# Altium schematic sheet 1.BTB.SchDoc
size A3; SheetNumber: 1; SheetTotal: 13
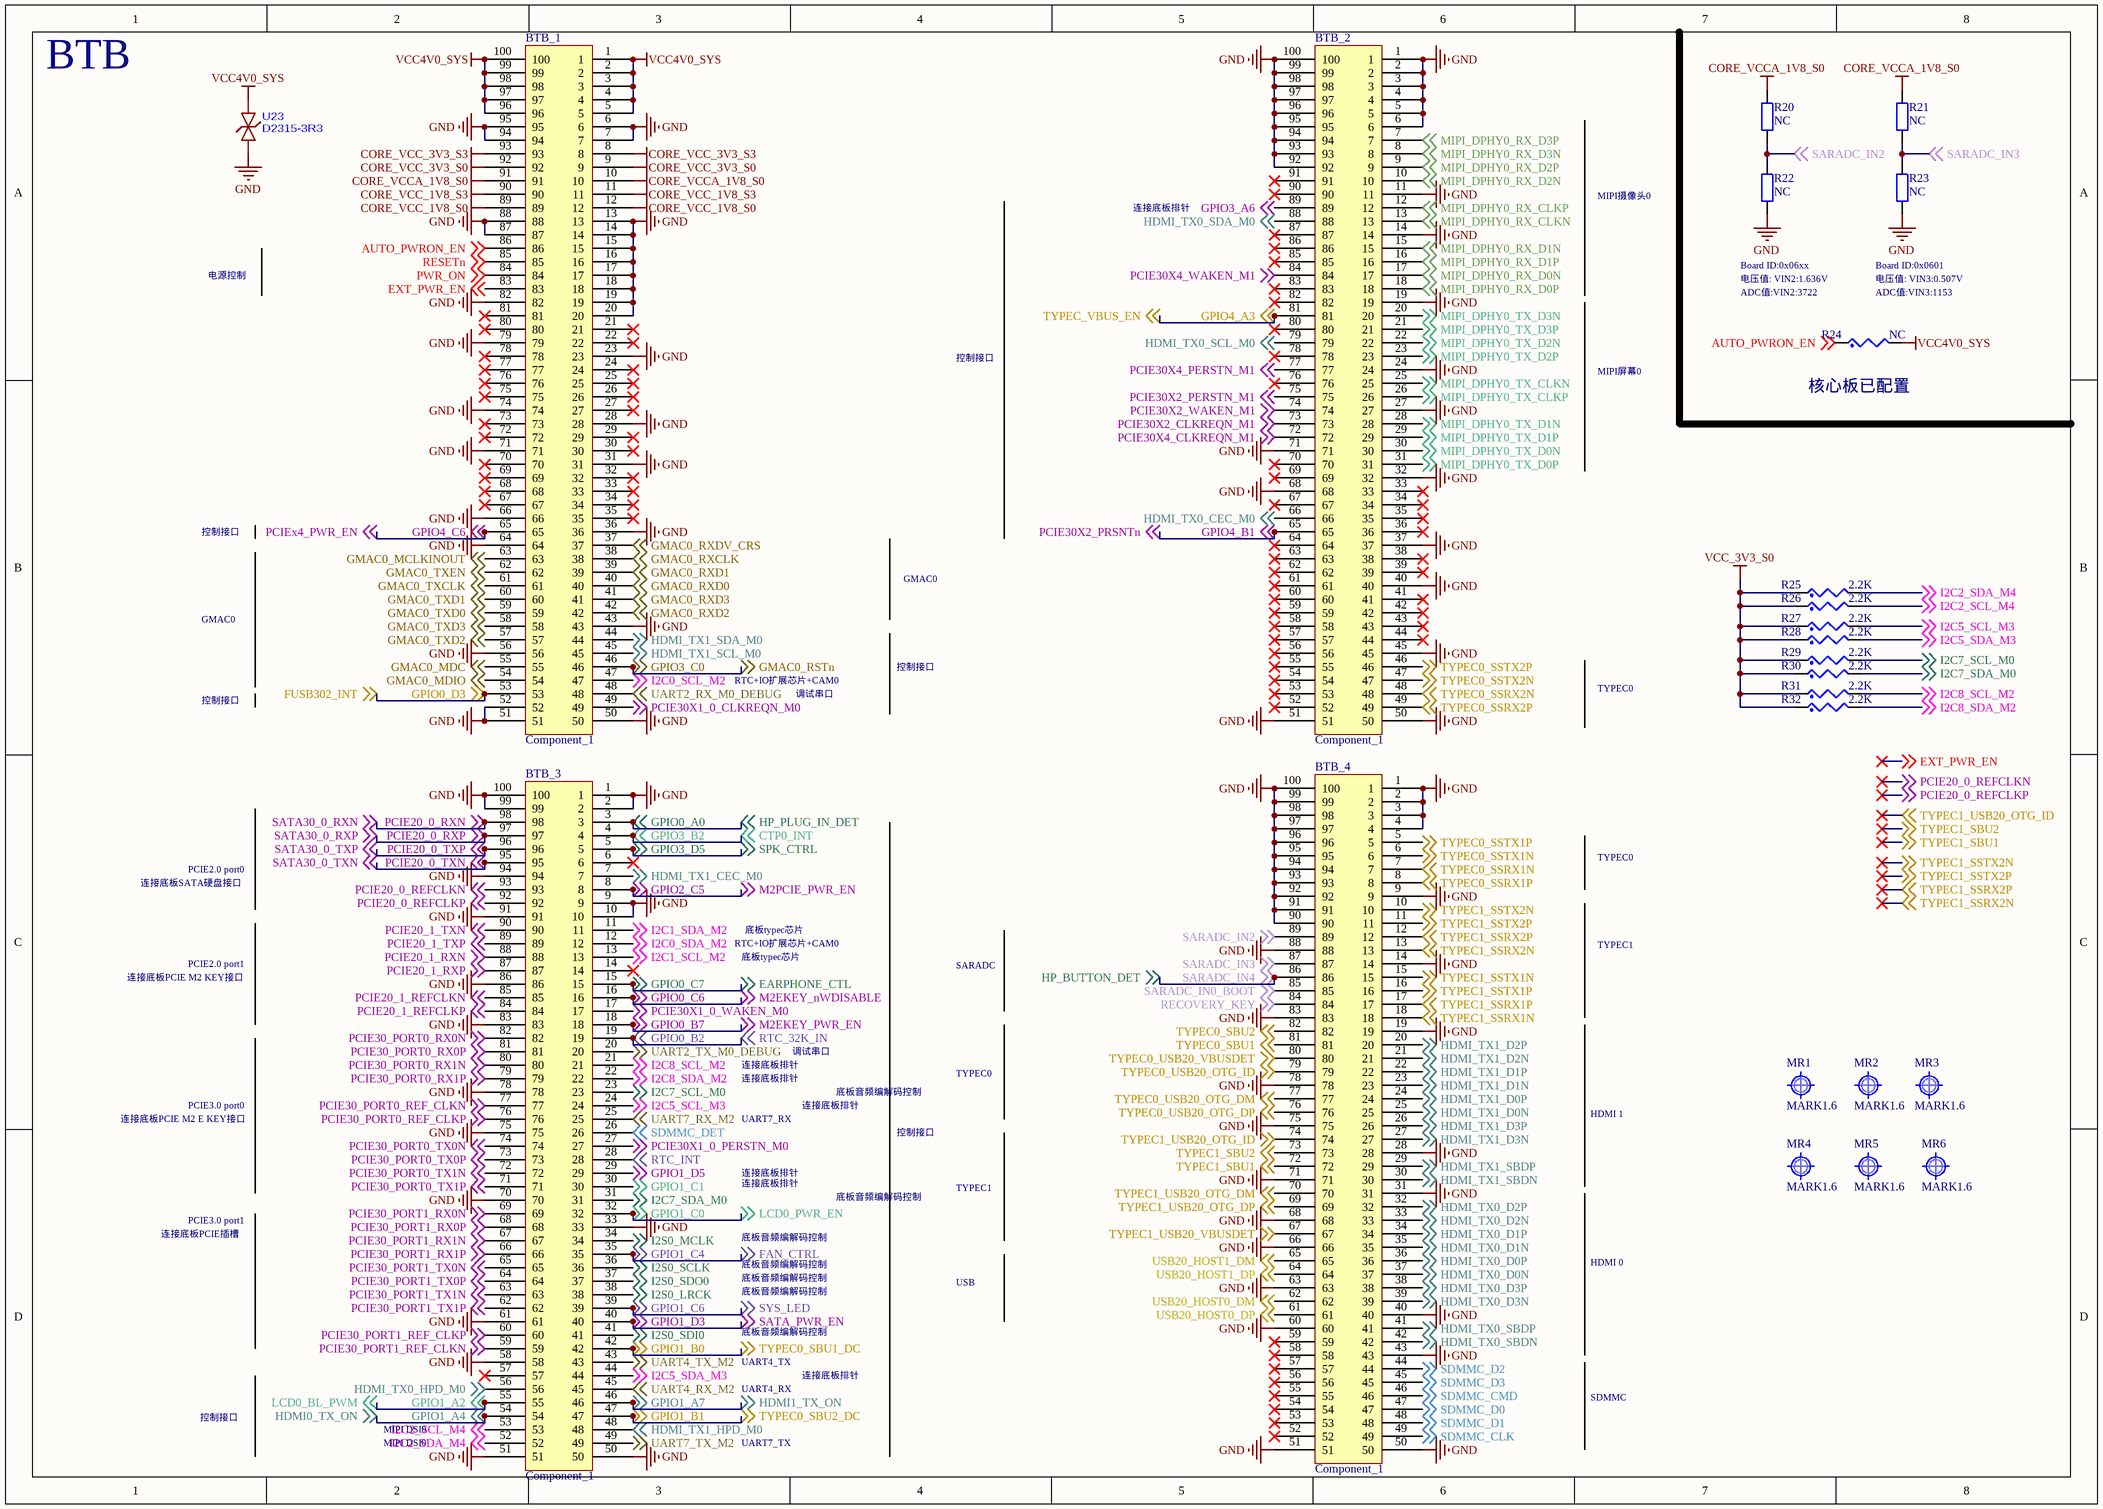
[diagram p0: 1.BTB.SchDoc]

## Parts
BTB_1  Component_1  [F_100PIN]
BTB_2  Component_1  [F_100PIN]
BTB_3  Component_1  [F_100PIN]
BTB_4  Component_1  [F_100PIN]
MR1  MARK1.6  [Mark 1]
MR2  MARK1.6  [Mark 1]
MR3  MARK1.6  [Mark 1]
MR4  MARK1.6  [Mark 1]
MR5  MARK1.6  [Mark 1]
MR6  MARK1.6  [Mark 1]
R20  NC  [R0402_L]
R21  NC  [R0402_L]
R22  NC  [R0402_L]
R23  NC  [R0402_L]
R24  NC  [R0402]
R25  2.2K  [R0402]
R26  2.2K  [R0402]
R27  2.2K  [R0402]
R28  2.2K  [R0402]
R29  2.2K  [R0402]
R30  2.2K  [R0402]
R31  2.2K  [R0402]
R32  2.2K  [R0402]
U23  D2315-3R3  [DFN1006-2L-BI]

## Nets
CORE_VCC_1V8_S0: BTB_1.12 BTB_1.89
CORE_VCC_1V8_S3: BTB_1.11 BTB_1.90
CORE_VCC_3V3_S0: BTB_1.9 BTB_1.92
CORE_VCC_3V3_S3: BTB_1.8 BTB_1.93
CORE_VCCA_1V8_S0: BTB_1.10 BTB_1.91 R20.2 R21.2
GND: BTB_1.6 BTB_1.7 BTB_1.13 BTB_1.14 BTB_1.15 BTB_1.16 BTB_1.17 BTB_1.18 BTB_1.19 BTB_1.20 BTB_1.23 BTB_1.28 BTB_1.31 BTB_1.36 BTB_1.43 BTB_1.50 BTB_1.51 BTB_1.52 BTB_1.56 BTB_1.64 BTB_1.66 BTB_1.71 BTB_1.74 BTB_1.79 BTB_1.82 BTB_1.87 BTB_1.88 BTB_1.94 BTB_1.95 BTB_2.1 BTB_2.2 BTB_2.3 BTB_2.4 BTB_2.5 BTB_2.6 BTB_2.11 BTB_2.14 BTB_2.19 BTB_2.24 BTB_2.27 BTB_2.32 BTB_2.37 BTB_2.40 BTB_2.45 BTB_2.50 BTB_2.51 BTB_2.68 BTB_2.71 BTB_2.92 BTB_2.93 BTB_2.94 BTB_2.95 BTB_2.96 BTB_2.97 BTB_2.98 BTB_2.99 BTB_2.100 BTB_3.1 BTB_3.2 BTB_3.9 BTB_3.10 BTB_3.33 BTB_3.50 BTB_3.51 BTB_3.58 BTB_3.61 BTB_3.70 BTB_3.75 BTB_3.78 BTB_3.83 BTB_3.86 BTB_3.91 BTB_3.94 BTB_3.99 BTB_3.100 BTB_4.1 BTB_4.2 BTB_4.3 BTB_4.4 BTB_4.9 BTB_4.14 BTB_4.19 BTB_4.28 BTB_4.31 BTB_4.40 BTB_4.43 BTB_4.50 BTB_4.51 BTB_4.60 BTB_4.63 BTB_4.66 BTB_4.68 BTB_4.71 BTB_4.75 BTB_4.78 BTB_4.83 BTB_4.88 BTB_4.90 BTB_4.91 BTB_4.92 BTB_4.93 BTB_4.94 BTB_4.95 BTB_4.96 BTB_4.97 BTB_4.98 BTB_4.99 BTB_4.100 R22.1 R23.1 U23.1
VCC4V0_SYS: BTB_1.1 BTB_1.2 BTB_1.3 BTB_1.4 BTB_1.5 BTB_1.96 BTB_1.97 BTB_1.98 BTB_1.99 BTB_1.100 R24.2 U23.2
VCC_3V3_S0: R25.1 R26.1 R27.1 R28.1 R29.1 R30.1 R31.1 R32.1
AUTO_PWRON_EN: BTB_1.86 R24.1 ; off-sheet AUTO_PWRON_EN
CTP0_INT: BTB_3.4 ; off-sheet GPIO3_B2, off-sheet CTP0_INT  [also labelled GPIO3_B2]
EARPHONE_CTL: BTB_3.15 ; off-sheet GPIO0_C7, off-sheet EARPHONE_CTL  [also labelled GPIO0_C7]
EXT_PWR_EN: BTB_1.83 ; off-sheet EXT_PWR_EN
FAN_CTRL: BTB_3.35 ; off-sheet GPIO1_C4, off-sheet FAN_CTRL  [also labelled GPIO1_C4]
FUSB302_INT: BTB_1.53 ; off-sheet GPIO0_D3, off-sheet FUSB302_INT  [also labelled GPIO0_D3]
GMAC0_MCLKINOUT: BTB_1.63 ; off-sheet GMAC0_MCLKINOUT
GMAC0_MDC: BTB_1.55 ; off-sheet GMAC0_MDC
GMAC0_MDIO: BTB_1.54 ; off-sheet GMAC0_MDIO
GMAC0_RSTn: BTB_1.46 ; off-sheet GPIO3_C0, off-sheet GMAC0_RSTn  [also labelled GPIO3_C0]
GMAC0_RXCLK: BTB_1.38 ; off-sheet GMAC0_RXCLK
GMAC0_RXD0: BTB_1.40 ; off-sheet GMAC0_RXD0
GMAC0_RXD1: BTB_1.39 ; off-sheet GMAC0_RXD1
GMAC0_RXD2: BTB_1.42 ; off-sheet GMAC0_RXD2
GMAC0_RXD3: BTB_1.41 ; off-sheet GMAC0_RXD3
GMAC0_RXDV_CRS: BTB_1.37 ; off-sheet GMAC0_RXDV_CRS
GMAC0_TXCLK: BTB_1.61 ; off-sheet GMAC0_TXCLK
GMAC0_TXD0: BTB_1.59 ; off-sheet GMAC0_TXD0
GMAC0_TXD1: BTB_1.60 ; off-sheet GMAC0_TXD1
GMAC0_TXD2: BTB_1.57 ; off-sheet GMAC0_TXD2
GMAC0_TXD3: BTB_1.58 ; off-sheet GMAC0_TXD3
GMAC0_TXEN: BTB_1.62 ; off-sheet GMAC0_TXEN
GPIO0_A0: BTB_3.3 ; off-sheet GPIO0_A0, off-sheet HP_PLUG_IN_DET  [also labelled HP_PLUG_IN_DET]
GPIO0_B2: BTB_3.19 ; off-sheet GPIO0_B2, off-sheet RTC_32K_IN  [also labelled RTC_32K_IN]
GPIO0_B7: BTB_3.18 ; off-sheet GPIO0_B7, off-sheet M2EKEY_PWR_EN  [also labelled M2EKEY_PWR_EN]
GPIO0_C6: BTB_3.16 ; off-sheet GPIO0_C6, off-sheet M2EKEY_nWDISABLE  [also labelled M2EKEY_nWDISABLE]
GPIO1_A2: BTB_3.55 ; off-sheet GPIO1_A2, off-sheet LCD0_BL_PWM  [also labelled LCD0_BL_PWM]
GPIO1_A4: BTB_3.54 ; off-sheet GPIO1_A4, off-sheet HDMI0_TX_ON  [also labelled HDMI0_TX_ON]
GPIO1_A7: BTB_3.46 ; off-sheet GPIO1_A7, off-sheet HDMI1_TX_ON  [also labelled HDMI1_TX_ON]
GPIO1_B0: BTB_3.42 ; off-sheet GPIO1_B0, off-sheet TYPEC0_SBU1_DC  [also labelled TYPEC0_SBU1_DC]
GPIO1_B1: BTB_3.47 ; off-sheet GPIO1_B1, off-sheet TYPEC0_SBU2_DC  [also labelled TYPEC0_SBU2_DC]
GPIO1_C0: BTB_3.32 ; off-sheet GPIO1_C0, off-sheet LCD0_PWR_EN  [also labelled LCD0_PWR_EN]
GPIO1_C1: BTB_3.30 ; off-sheet GPIO1_C1
GPIO1_C6: BTB_3.39 ; off-sheet GPIO1_C6, off-sheet SYS_LED  [also labelled SYS_LED]
GPIO1_D3: BTB_3.40 ; off-sheet GPIO1_D3, off-sheet SATA_PWR_EN  [also labelled SATA_PWR_EN]
GPIO1_D5: BTB_3.29 ; off-sheet GPIO1_D5
GPIO2_C5: BTB_3.8 ; off-sheet GPIO2_C5, off-sheet M2PCIE_PWR_EN  [also labelled M2PCIE_PWR_EN]
GPIO3_A6: BTB_2.89 ; off-sheet GPIO3_A6
GPIO3_D5: BTB_3.5 ; off-sheet GPIO3_D5, off-sheet SPK_CTRL  [also labelled SPK_CTRL]
GPIO4_A3: BTB_2.81 ; off-sheet GPIO4_A3, off-sheet TYPEC_VBUS_EN  [also labelled TYPEC_VBUS_EN]
GPIO4_B1: BTB_2.65 ; off-sheet GPIO4_B1, off-sheet PCIE30X2_PRSNTn  [also labelled PCIE30X2_PRSNTn]
GPIO4_C6: BTB_1.65 ; off-sheet GPIO4_C6, off-sheet PCIEx4_PWR_EN  [also labelled PCIEx4_PWR_EN]
HDMI_TX0_CEC_M0: BTB_2.66 ; off-sheet HDMI_TX0_CEC_M0
HDMI_TX0_D0N: BTB_4.37 ; off-sheet HDMI_TX0_D0N
HDMI_TX0_D0P: BTB_4.36 ; off-sheet HDMI_TX0_D0P
HDMI_TX0_D1N: BTB_4.35 ; off-sheet HDMI_TX0_D1N
HDMI_TX0_D1P: BTB_4.34 ; off-sheet HDMI_TX0_D1P
HDMI_TX0_D2N: BTB_4.33 ; off-sheet HDMI_TX0_D2N
HDMI_TX0_D2P: BTB_4.32 ; off-sheet HDMI_TX0_D2P
HDMI_TX0_D3N: BTB_4.39 ; off-sheet HDMI_TX0_D3N
HDMI_TX0_D3P: BTB_4.38 ; off-sheet HDMI_TX0_D3P
HDMI_TX0_HPD_M0: BTB_3.56 ; off-sheet HDMI_TX0_HPD_M0
HDMI_TX0_SBDN: BTB_4.42 ; off-sheet HDMI_TX0_SBDN
HDMI_TX0_SBDP: BTB_4.41 ; off-sheet HDMI_TX0_SBDP
HDMI_TX0_SCL_M0: BTB_2.79 ; off-sheet HDMI_TX0_SCL_M0
HDMI_TX0_SDA_M0: BTB_2.88 ; off-sheet HDMI_TX0_SDA_M0
HDMI_TX1_CEC_M0: BTB_3.7 ; off-sheet HDMI_TX1_CEC_M0
HDMI_TX1_D0N: BTB_4.25 ; off-sheet HDMI_TX1_D0N
HDMI_TX1_D0P: BTB_4.24 ; off-sheet HDMI_TX1_D0P
HDMI_TX1_D1N: BTB_4.23 ; off-sheet HDMI_TX1_D1N
HDMI_TX1_D1P: BTB_4.22 ; off-sheet HDMI_TX1_D1P
HDMI_TX1_D2N: BTB_4.21 ; off-sheet HDMI_TX1_D2N
HDMI_TX1_D2P: BTB_4.20 ; off-sheet HDMI_TX1_D2P
HDMI_TX1_D3N: BTB_4.27 ; off-sheet HDMI_TX1_D3N
HDMI_TX1_D3P: BTB_4.26 ; off-sheet HDMI_TX1_D3P
HDMI_TX1_HPD_M0: BTB_3.48 ; off-sheet HDMI_TX1_HPD_M0
HDMI_TX1_SBDN: BTB_4.30 ; off-sheet HDMI_TX1_SBDN
HDMI_TX1_SBDP: BTB_4.29 ; off-sheet HDMI_TX1_SBDP
HDMI_TX1_SCL_M0: BTB_1.45 ; off-sheet HDMI_TX1_SCL_M0
HDMI_TX1_SDA_M0: BTB_1.44 ; off-sheet HDMI_TX1_SDA_M0
HP_BUTTON_DET: BTB_4.86 ; off-sheet SARADC_IN4, off-sheet HP_BUTTON_DET  [also labelled SARADC_IN4]
I2C0_SCL_M2: BTB_1.47 ; off-sheet I2C0_SCL_M2
I2C0_SDA_M2: BTB_3.12 ; off-sheet I2C0_SDA_M2
I2C1_SCL_M2: BTB_3.13 ; off-sheet I2C1_SCL_M2
I2C1_SDA_M2: BTB_3.11 ; off-sheet I2C1_SDA_M2
I2C2_SCL_M4: BTB_3.53 R26.2 ; off-sheet I2C2_SCL_M4
I2C2_SDA_M4: BTB_3.52 R25.2 ; off-sheet I2C2_SDA_M4
I2C5_SCL_M3: BTB_3.24 R27.2 ; off-sheet I2C5_SCL_M3
I2C5_SDA_M3: BTB_3.44 R28.2 ; off-sheet I2C5_SDA_M3
I2C7_SCL_M0: BTB_3.23 R29.2 ; off-sheet I2C7_SCL_M0
I2C7_SDA_M0: BTB_3.31 R30.2 ; off-sheet I2C7_SDA_M0
I2C8_SCL_M2: BTB_3.21 R31.2 ; off-sheet I2C8_SCL_M2
I2C8_SDA_M2: BTB_3.22 R32.2 ; off-sheet I2C8_SDA_M2
I2S0_LRCK: BTB_3.38 ; off-sheet I2S0_LRCK
I2S0_MCLK: BTB_3.34 ; off-sheet I2S0_MCLK
I2S0_SCLK: BTB_3.36 ; off-sheet I2S0_SCLK
I2S0_SDI0: BTB_3.41 ; off-sheet I2S0_SDI0
I2S0_SDO0: BTB_3.37 ; off-sheet I2S0_SDO0
MIPI_DPHY0_RX_CLKN: BTB_2.13 ; off-sheet MIPI_DPHY0_RX_CLKN
MIPI_DPHY0_RX_CLKP: BTB_2.12 ; off-sheet MIPI_DPHY0_RX_CLKP
MIPI_DPHY0_RX_D0N: BTB_2.17 ; off-sheet MIPI_DPHY0_RX_D0N
MIPI_DPHY0_RX_D0P: BTB_2.18 ; off-sheet MIPI_DPHY0_RX_D0P
MIPI_DPHY0_RX_D1N: BTB_2.15 ; off-sheet MIPI_DPHY0_RX_D1N
MIPI_DPHY0_RX_D1P: BTB_2.16 ; off-sheet MIPI_DPHY0_RX_D1P
MIPI_DPHY0_RX_D2N: BTB_2.10 ; off-sheet MIPI_DPHY0_RX_D2N
MIPI_DPHY0_RX_D2P: BTB_2.9 ; off-sheet MIPI_DPHY0_RX_D2P
MIPI_DPHY0_RX_D3N: BTB_2.8 ; off-sheet MIPI_DPHY0_RX_D3N
MIPI_DPHY0_RX_D3P: BTB_2.7 ; off-sheet MIPI_DPHY0_RX_D3P
MIPI_DPHY0_TX_CLKN: BTB_2.25 ; off-sheet MIPI_DPHY0_TX_CLKN
MIPI_DPHY0_TX_CLKP: BTB_2.26 ; off-sheet MIPI_DPHY0_TX_CLKP
MIPI_DPHY0_TX_D0N: BTB_2.30 ; off-sheet MIPI_DPHY0_TX_D0N
MIPI_DPHY0_TX_D0P: BTB_2.31 ; off-sheet MIPI_DPHY0_TX_D0P
MIPI_DPHY0_TX_D1N: BTB_2.28 ; off-sheet MIPI_DPHY0_TX_D1N
MIPI_DPHY0_TX_D1P: BTB_2.29 ; off-sheet MIPI_DPHY0_TX_D1P
MIPI_DPHY0_TX_D2N: BTB_2.22 ; off-sheet MIPI_DPHY0_TX_D2N
MIPI_DPHY0_TX_D2P: BTB_2.23 ; off-sheet MIPI_DPHY0_TX_D2P
MIPI_DPHY0_TX_D3N: BTB_2.20 ; off-sheet MIPI_DPHY0_TX_D3N
MIPI_DPHY0_TX_D3P: BTB_2.21 ; off-sheet MIPI_DPHY0_TX_D3P
PCIE20_0_REFCLKN: BTB_3.93 ; off-sheet PCIE20_0_REFCLKN
PCIE20_0_REFCLKP: BTB_3.92 ; off-sheet PCIE20_0_REFCLKP
PCIE20_0_RXN: BTB_3.98 ; off-sheet PCIE20_0_RXN, off-sheet SATA30_0_RXN  [also labelled SATA30_0_RXN]
PCIE20_0_RXP: BTB_3.97 ; off-sheet PCIE20_0_RXP, off-sheet SATA30_0_RXP  [also labelled SATA30_0_RXP]
PCIE20_0_TXN: BTB_3.95 ; off-sheet PCIE20_0_TXN, off-sheet SATA30_0_TXN  [also labelled SATA30_0_TXN]
PCIE20_0_TXP: BTB_3.96 ; off-sheet PCIE20_0_TXP, off-sheet SATA30_0_TXP  [also labelled SATA30_0_TXP]
PCIE20_1_REFCLKN: BTB_3.85 ; off-sheet PCIE20_1_REFCLKN
PCIE20_1_REFCLKP: BTB_3.84 ; off-sheet PCIE20_1_REFCLKP
PCIE20_1_RXN: BTB_3.88 ; off-sheet PCIE20_1_RXN
PCIE20_1_RXP: BTB_3.87 ; off-sheet PCIE20_1_RXP
PCIE20_1_TXN: BTB_3.90 ; off-sheet PCIE20_1_TXN
PCIE20_1_TXP: BTB_3.89 ; off-sheet PCIE20_1_TXP
PCIE30_PORT0_REF_CLKN: BTB_3.77 ; off-sheet PCIE30_PORT0_REF_CLKN
PCIE30_PORT0_REF_CLKP: BTB_3.76 ; off-sheet PCIE30_PORT0_REF_CLKP
PCIE30_PORT0_RX0N: BTB_3.82 ; off-sheet PCIE30_PORT0_RX0N
PCIE30_PORT0_RX0P: BTB_3.81 ; off-sheet PCIE30_PORT0_RX0P
PCIE30_PORT0_RX1N: BTB_3.80 ; off-sheet PCIE30_PORT0_RX1N
PCIE30_PORT0_RX1P: BTB_3.79 ; off-sheet PCIE30_PORT0_RX1P
PCIE30_PORT0_TX0N: BTB_3.74 ; off-sheet PCIE30_PORT0_TX0N
PCIE30_PORT0_TX0P: BTB_3.73 ; off-sheet PCIE30_PORT0_TX0P
PCIE30_PORT0_TX1N: BTB_3.72 ; off-sheet PCIE30_PORT0_TX1N
PCIE30_PORT0_TX1P: BTB_3.71 ; off-sheet PCIE30_PORT0_TX1P
PCIE30_PORT1_REF_CLKN: BTB_3.59 ; off-sheet PCIE30_PORT1_REF_CLKN
PCIE30_PORT1_REF_CLKP: BTB_3.60 ; off-sheet PCIE30_PORT1_REF_CLKP
PCIE30_PORT1_RX0N: BTB_3.69 ; off-sheet PCIE30_PORT1_RX0N
PCIE30_PORT1_RX0P: BTB_3.68 ; off-sheet PCIE30_PORT1_RX0P
PCIE30_PORT1_RX1N: BTB_3.67 ; off-sheet PCIE30_PORT1_RX1N
PCIE30_PORT1_RX1P: BTB_3.66 ; off-sheet PCIE30_PORT1_RX1P
PCIE30_PORT1_TX0N: BTB_3.65 ; off-sheet PCIE30_PORT1_TX0N
PCIE30_PORT1_TX0P: BTB_3.64 ; off-sheet PCIE30_PORT1_TX0P
PCIE30_PORT1_TX1N: BTB_3.63 ; off-sheet PCIE30_PORT1_TX1N
PCIE30_PORT1_TX1P: BTB_3.62 ; off-sheet PCIE30_PORT1_TX1P
PCIE30X1_0_CLKREQN_M0: BTB_1.49 ; off-sheet PCIE30X1_0_CLKREQN_M0
PCIE30X1_0_PERSTN_M0: BTB_3.27 ; off-sheet PCIE30X1_0_PERSTN_M0
PCIE30X1_0_WAKEN_M0: BTB_3.17 ; off-sheet PCIE30X1_0_WAKEN_M0
PCIE30X2_CLKREQN_M1: BTB_2.73 ; off-sheet PCIE30X2_CLKREQN_M1
PCIE30X2_PERSTN_M1: BTB_2.75 ; off-sheet PCIE30X2_PERSTN_M1
PCIE30X2_WAKEN_M1: BTB_2.74 ; off-sheet PCIE30X2_WAKEN_M1
PCIE30X4_CLKREQN_M1: BTB_2.72 ; off-sheet PCIE30X4_CLKREQN_M1
PCIE30X4_PERSTN_M1: BTB_2.77 ; off-sheet PCIE30X4_PERSTN_M1
PCIE30X4_WAKEN_M1: BTB_2.84 ; off-sheet PCIE30X4_WAKEN_M1
PWR_ON: BTB_1.84 ; off-sheet PWR_ON
RECOVERY_KEY: BTB_4.84 ; off-sheet RECOVERY_KEY
RESETn: BTB_1.85 ; off-sheet RESETn
RTC_INT: BTB_3.28 ; off-sheet RTC_INT
SARADC_IN0_BOOT: BTB_4.85 ; off-sheet SARADC_IN0_BOOT
SARADC_IN2: BTB_4.89 R20.1 R22.2 ; off-sheet SARADC_IN2
SARADC_IN3: BTB_4.87 R21.1 R23.2 ; off-sheet SARADC_IN3
SDMMC_CLK: BTB_4.49 ; off-sheet SDMMC_CLK
SDMMC_CMD: BTB_4.46 ; off-sheet SDMMC_CMD
SDMMC_D0: BTB_4.47 ; off-sheet SDMMC_D0
SDMMC_D1: BTB_4.48 ; off-sheet SDMMC_D1
SDMMC_D2: BTB_4.44 ; off-sheet SDMMC_D2
SDMMC_D3: BTB_4.45 ; off-sheet SDMMC_D3
SDMMC_DET: BTB_3.26 ; off-sheet SDMMC_DET
TYPEC0_SBU1: BTB_4.81 ; off-sheet TYPEC0_SBU1
TYPEC0_SBU2: BTB_4.82 ; off-sheet TYPEC0_SBU2
TYPEC0_SSRX1N: BTB_4.7 ; off-sheet TYPEC0_SSRX1N
TYPEC0_SSRX1P: BTB_4.8 ; off-sheet TYPEC0_SSRX1P
TYPEC0_SSRX2N: BTB_2.48 ; off-sheet TYPEC0_SSRX2N
TYPEC0_SSRX2P: BTB_2.49 ; off-sheet TYPEC0_SSRX2P
TYPEC0_SSTX1N: BTB_4.6 ; off-sheet TYPEC0_SSTX1N
TYPEC0_SSTX1P: BTB_4.5 ; off-sheet TYPEC0_SSTX1P
TYPEC0_SSTX2N: BTB_2.47 ; off-sheet TYPEC0_SSTX2N
TYPEC0_SSTX2P: BTB_2.46 ; off-sheet TYPEC0_SSTX2P
TYPEC0_USB20_OTG_DM: BTB_4.77 ; off-sheet TYPEC0_USB20_OTG_DM
TYPEC0_USB20_OTG_DP: BTB_4.76 ; off-sheet TYPEC0_USB20_OTG_DP
TYPEC0_USB20_OTG_ID: BTB_4.79 ; off-sheet TYPEC0_USB20_OTG_ID
TYPEC0_USB20_VBUSDET: BTB_4.80 ; off-sheet TYPEC0_USB20_VBUSDET
TYPEC1_SBU1: BTB_4.72 ; off-sheet TYPEC1_SBU1
TYPEC1_SBU2: BTB_4.73 ; off-sheet TYPEC1_SBU2
TYPEC1_SSRX1N: BTB_4.18 ; off-sheet TYPEC1_SSRX1N
TYPEC1_SSRX1P: BTB_4.17 ; off-sheet TYPEC1_SSRX1P
TYPEC1_SSRX2N: BTB_4.13 ; off-sheet TYPEC1_SSRX2N
TYPEC1_SSRX2P: BTB_4.12 ; off-sheet TYPEC1_SSRX2P
TYPEC1_SSTX1N: BTB_4.15 ; off-sheet TYPEC1_SSTX1N
TYPEC1_SSTX1P: BTB_4.16 ; off-sheet TYPEC1_SSTX1P
TYPEC1_SSTX2N: BTB_4.10 ; off-sheet TYPEC1_SSTX2N
TYPEC1_SSTX2P: BTB_4.11 ; off-sheet TYPEC1_SSTX2P
TYPEC1_USB20_OTG_DM: BTB_4.70 ; off-sheet TYPEC1_USB20_OTG_DM
TYPEC1_USB20_OTG_DP: BTB_4.69 ; off-sheet TYPEC1_USB20_OTG_DP
TYPEC1_USB20_OTG_ID: BTB_4.74 ; off-sheet TYPEC1_USB20_OTG_ID
TYPEC1_USB20_VBUSDET: BTB_4.67 ; off-sheet TYPEC1_USB20_VBUSDET
UART2_RX_M0_DEBUG: BTB_1.48 ; off-sheet UART2_RX_M0_DEBUG
UART2_TX_M0_DEBUG: BTB_3.20 ; off-sheet UART2_TX_M0_DEBUG
UART4_RX_M2: BTB_3.45 ; off-sheet UART4_RX_M2
UART4_TX_M2: BTB_3.43 ; off-sheet UART4_TX_M2
UART7_RX_M2: BTB_3.25 ; off-sheet UART7_RX_M2
UART7_TX_M2: BTB_3.49 ; off-sheet UART7_TX_M2
USB20_HOST0_DM: BTB_4.62 ; off-sheet USB20_HOST0_DM
USB20_HOST0_DP: BTB_4.61 ; off-sheet USB20_HOST0_DP
USB20_HOST1_DM: BTB_4.65 ; off-sheet USB20_HOST1_DM
USB20_HOST1_DP: BTB_4.64 ; off-sheet USB20_HOST1_DP

Not connected (* = marked no-connect by the designer): BTB_1 21* 22* 24* 25* 26* 27* 29* 30* 32* 33* 34* 35* 67* 68* 69* 70* 72* 73* 75* 76* 77* 78* 80* 81*; BTB_2 33* 34* 35* 36* 38* 39* 41* 42* 43* 44* 52* 53* 54* 55* 56* 57* 58* 59* 60* 61* 62* 63* 64* 67* 69* 70* 76* 78* 80* 82* 83* 85* 86* 87* 90* 91*; BTB_3 6* 14* 57*; BTB_4 52* 53* 54* 55* 56* 57* 58* 59*

## Notes on the sheet
- BTB
- 连接底板排针
- MIPI摄像头0
- 电源控制
- Board ID:0x06xx
- 电压值: VIN2:1.636V
- ADC值:VIN2:3722
- Board ID:0x0601
- 电压值: VIN3:0.507V
- (near R24) ADC值:VIN3:1153
- 控制接口
- MIPI屏幕0
- (near R24) 核心板已配置
- GMAC0
- RTC+IO扩展芯片+CAM0
- 调试串口
- TYPEC0
- 连接底板SATA硬盘接口
- PCIE2.0 port0
- 连接底板PCIE M2 KEY接口
- PCIE2.0 port1
- 底板typec芯片
- SARADC
- TYPEC1
- 连接底板PCIE M2 E KEY接口
- PCIE3.0 port0
- UART7_RX
- 底板音频编解码控制
- HDMI 1
- 连接底板PCIE插槽
- PCIE3.0 port1
- USB
- HDMI 0
- UART4_RX
- UART4_TX
- MIPI DSI0
- UART7_TX
- SDMMC

## Library data of the parts
BTB_1-BTB_4 = Component_1_1
MR1-MR6 = MARK: 光学定位点
R20-R23 = R: 贴片电阻
R24-R32 = RES